# EAGLE design MD (EAGLE 9.6.2)
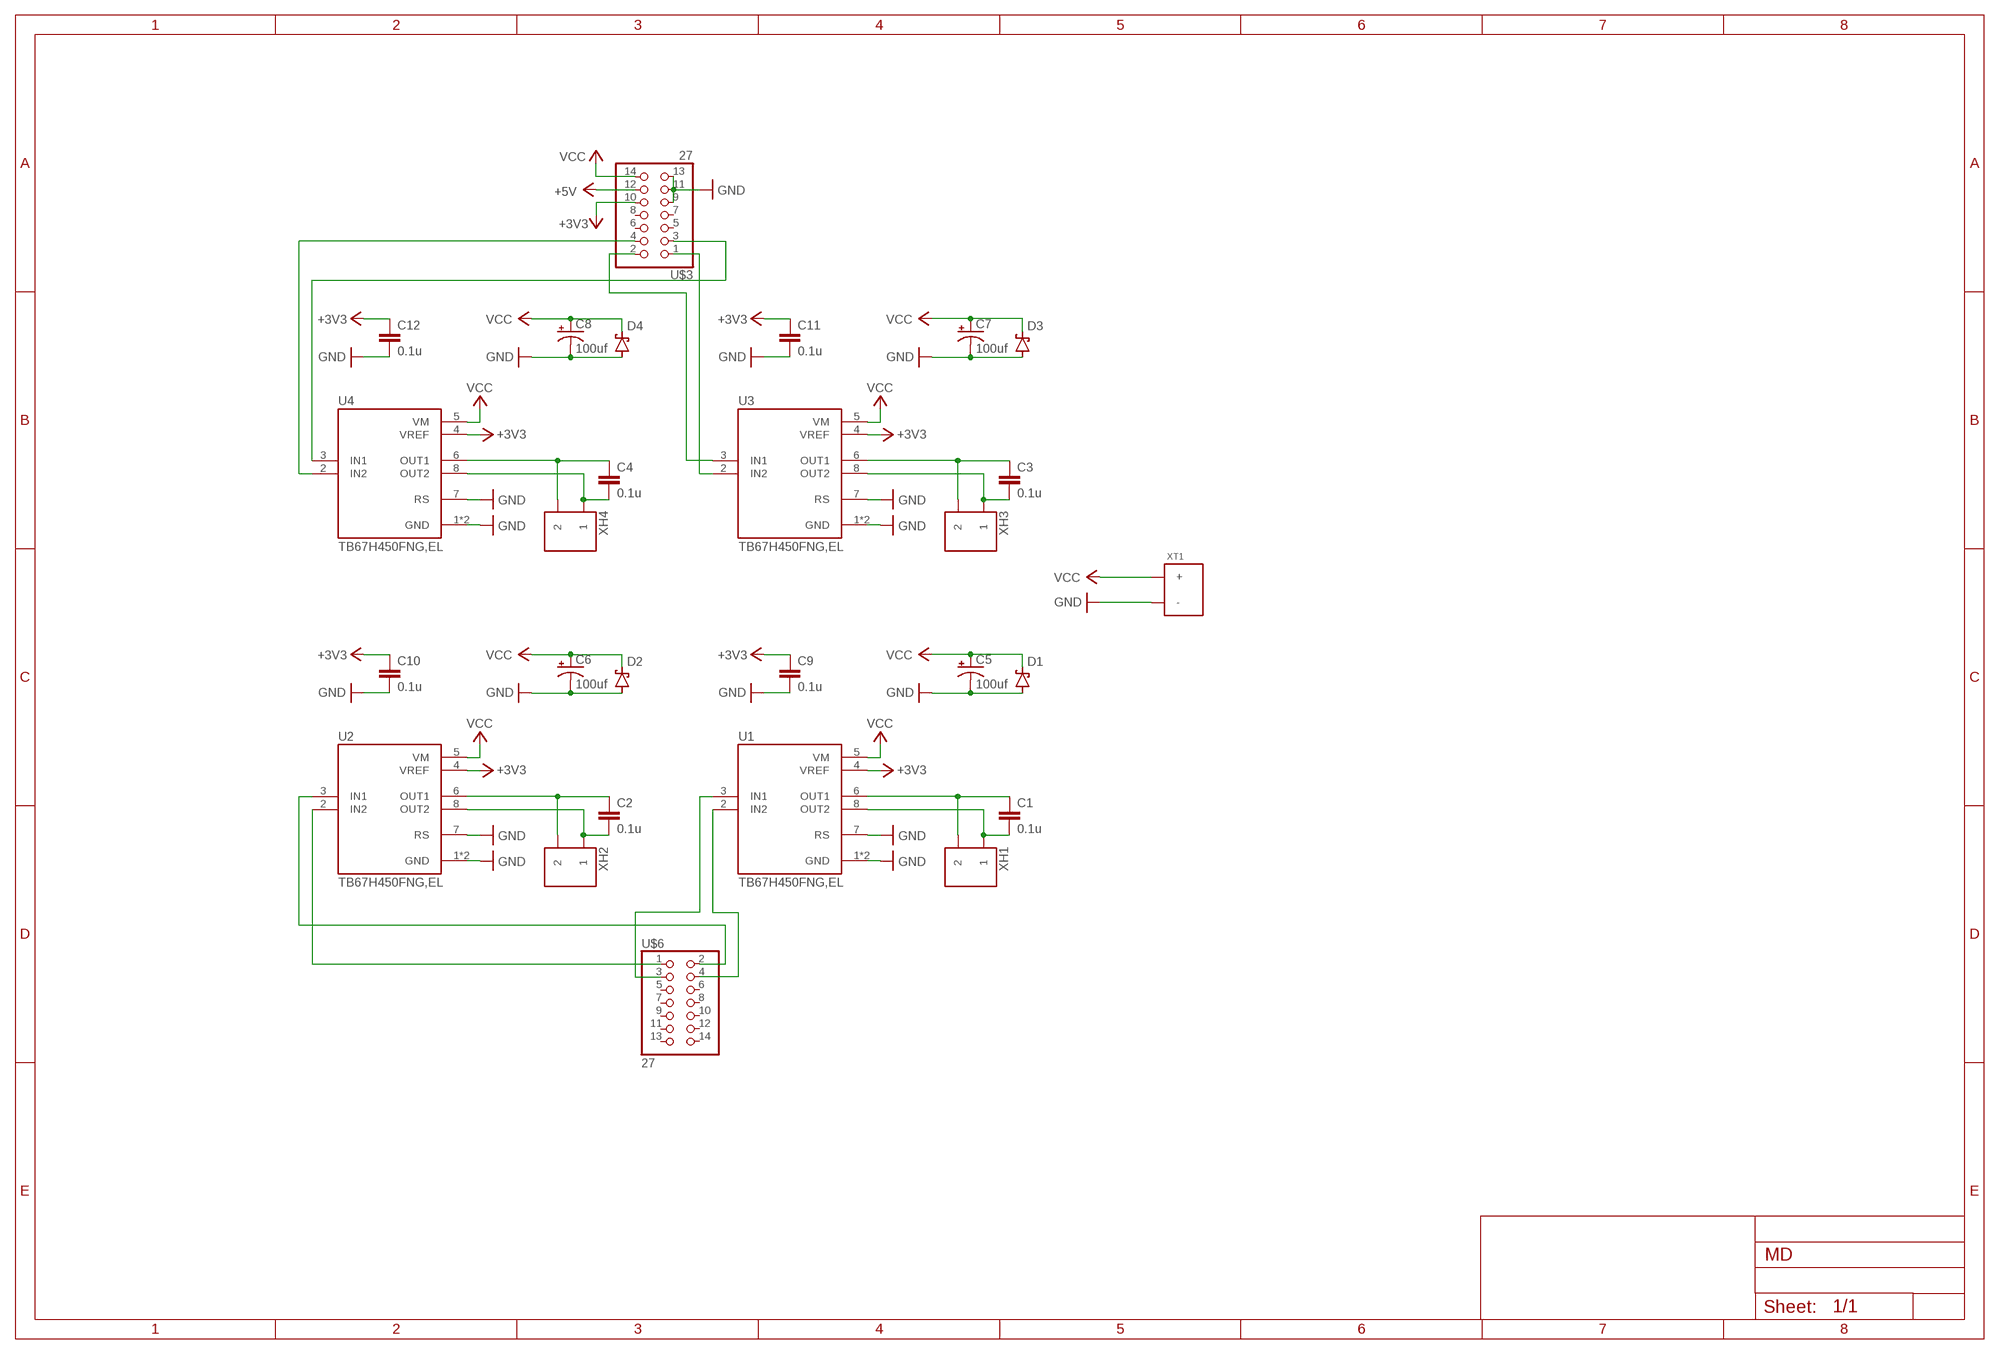
[diagram p0: schematic, sheet 1]

## Parts
C1  0.1u  C-EUC0603  [C0603]
C2  0.1u  C-EUC0603  [C0603]
C3  0.1u  C-EUC0603  [C0603]
C4  0.1u  C-EUC0603  [C0603]
C5  100uf  MH5  [MH5]
C6  100uf  MH5  [MH5]
C7  100uf  MH5  [MH5]
C8  100uf  MH5  [MH5]
C9  0.1u  C-EUC0603  [C0603]
C10  0.1u  C-EUC0603  [C0603]
C11  0.1u  C-EUC0603  [C0603]
C12  0.1u  C-EUC0603  [C0603]
D1  SS2040FL  [SOD123FL]
D2  SS2040FL  [SOD123FL]
D3  SS2040FL  [SOD123FL]
D4  SS2040FL  [SOD123FL]
U1  TB67H450FNG,EL  [SOIC127P599X175-9N]
U2  TB67H450FNG,EL  [SOIC127P599X175-9N]
U3  TB67H450FNG,EL  [SOIC127P599X175-9N]
U4  TB67H450FNG,EL  [SOIC127P599X175-9N]
U$3  27  [2*7]
U$6  27  [2*7]
XH1  S2B  [S2B]
XH2  S2B  [S2B]
XH3  S2B  [S2B]
XH4  S2B  [S2B]
XT1  XT30PW-M  [XT30PW-M]

## Nets
+3V3: C9.1 C10.1 C11.1 C12.1 U1.4(VREF) U2.4(VREF) U3.4(VREF) U4.4(VREF) U$3.10
+5V: U$3.12
GND: C5.- C6.- C7.- C8.- C9.2 C10.2 C11.2 C12.2 D1.A D2.A D3.A D4.A U1.1(GND) U1.7(RS) U1.9(GND) U2.1(GND) U2.7(RS) U2.9(GND) U3.1(GND) U3.7(RS) U3.9(GND) U4.1(GND) U4.7(RS) U4.9(GND) U$3.9 U$3.11 U$3.13 XT1.-
N$1: U1.3(IN1) U$6.3
N$2: C1.1 U1.6(OUT1) XH1.2
N$3: C1.2 U1.8(OUT2) XH1.1
N$4: C2.1 U2.6(OUT1) XH2.2
N$5: U1.2(IN2) U$6.4
N$6: C2.2 U2.8(OUT2) XH2.1
N$7: C3.1 U3.6(OUT1) XH3.2
N$8: C3.2 U3.8(OUT2) XH3.1
N$9: C4.1 U4.6(OUT1) XH4.2
N$10: C4.2 U4.8(OUT2) XH4.1
N$11: U2.3(IN1) U$6.2
N$12: U2.2(IN2) U$6.1
N$13: U3.2(IN2) U$3.1
N$14: U3.3(IN1) U$3.2
N$16: U4.2(IN2) U$3.4
N$17: U4.3(IN1) U$3.3
VCC: C5.+ C6.+ C7.+ C8.+ D1.C D2.C D3.C D4.C U1.5(VM) U2.5(VM) U3.5(VM) U4.5(VM) U$3.14 XT1.+
Unconnected: U$3.5 U$3.6 U$3.7 U$3.8 U$6.5 U$6.6 U$6.7 U$6.8 U$6.9 U$6.10 U$6.11 U$6.12 U$6.13 U$6.14

## Library data of the parts
C1-C4 C9-C12 = rcl:C-EU: CAPACITOR, European symbol; SPICEPREFIX: C
C5-C8 = capacitor:MH5
D1-D4 = diode:SS2040FL
U1-U4 = TB67H450FNG_EL:TB67H450FNG,EL: Check availability <https://pricing.snapeda.com/parts/TB67H450FNG%2CEL/Toshiba%20Semiconductor%20and%20Storage/view-part?ref=eda>; AVAILABILITY: In Stock; DESCRIPTION: - Motor Driver - - 8-HSOP; MF: Toshiba Semiconductor and Storage; MP: TB67H450FNG,EL; PACKAGE: SOIC-8 Toshiba Semiconductor and Storage; PRICE: None; PURCHASE-URL: https://pricing.snapeda.com/search/part/TB67H450FNG,EL/?ref=eda
U$3 U$6 = pin_socket:2*7
XH1-XH4 = XH:S2B
XT1 = XT:XT30PW-M

## Board
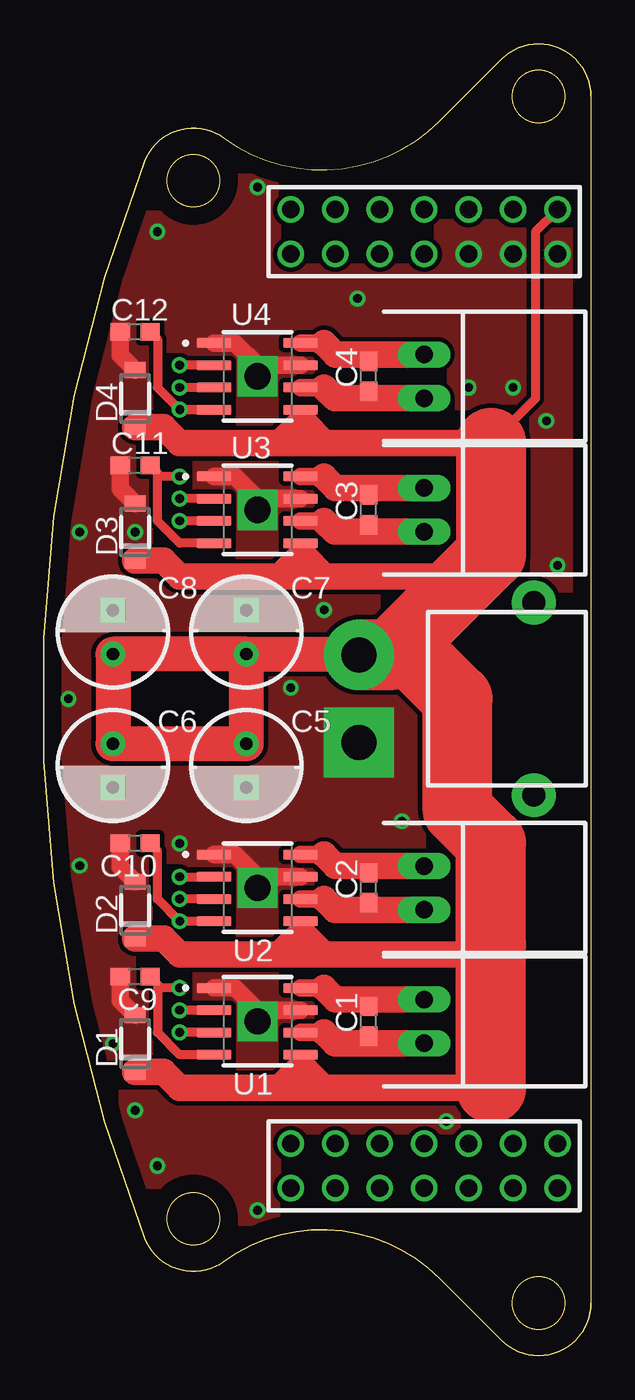
[diagram p1: board, top side]
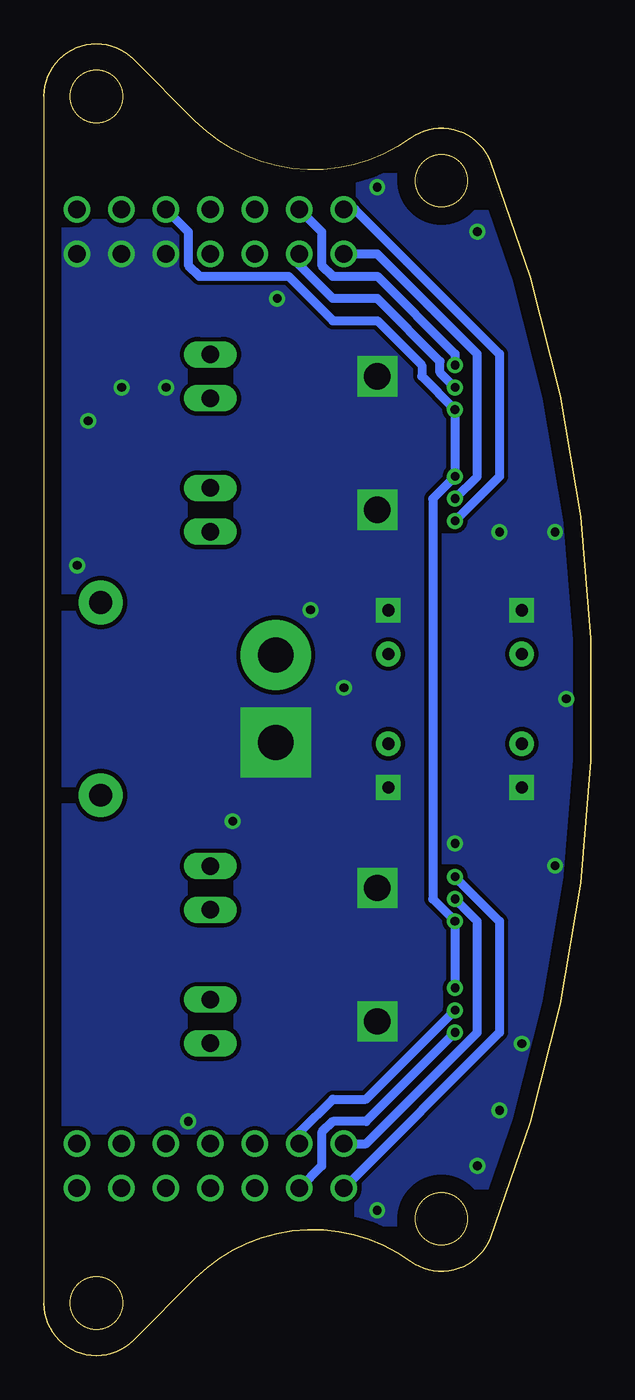
[diagram p2: board, bottom side, seen from below]

Size 31.26 x 74.91 mm. Coordinates in mm from the lower left corner, seen from the top.
Outline: 10.31,69.53 arc104 5.75,68.19
Outline: 5.75,68.19 arc43 5.75,6.72
Outline: 5.75,6.72 arc104 10.31,5.39
Outline: 10.31,5.39 arc-81 22.6,4.41
Outline: 22.6,4.41 26.14,0.88
Outline: 26.14,0.88 arc135 31.26,3
Outline: 31.26,71.91 arc135 26.14,74.03
Outline: 22.6,4.41 arc81 10.31,5.39
Outline: 10.31,5.39 arc-104 5.75,6.72
Outline: 5.75,6.72 arc-43 5.75,68.19
Outline: 5.75,68.19 arc-104 10.31,69.53
Outline: 10.31,69.53 arc81 22.6,70.5 26.14,74.03
Outline: 26.14,74.03 arc-135 31.26,71.91
Outline: 31.26,71.91 31.26,3
Outline: 31.26,3 arc-135 26.14,0.88
Outline: circle at 8.55,7.82 radius 1.5
Outline: circle at 28.26,71.91 radius 1.5
Outline: circle at 8.55,67.1 radius 1.5
Outline: circle at 28.26,3 radius 1.5
Copper layers (1*16): Top 0.035mm / dielectric 1.5mm / Bottom 0.035mm
Design rules "default": minimum track width 6mil, minimum drill 0.35mm, track to track 6mil, track to pad 6mil, pad to pad 6mil, via to via 6mil, smd to smd 6mil, copper to edge 40mil, drill to drill 6mil, minimum pad ring 10mil, minimum via ring 8mil, stop-mask expansion 4mil, vias tented up to drill 0mil, thermal gap 10mil

### Footprints (pad centres in the part's own frame; a part is rotated, then mirrored left to right if it is on the bottom)
C0603 = smd 1.1 x 1: 1 -0.85,0; 2 0.85,0
MH5 = drill 0.7 pad 1.4: + 1.25,0 | drill 0.7 pad 1.4 square: - -1.25,0
SOD123FL = smd 0.91 x 1.22: A 1.625,0; C -1.625,0
SOIC127P599X175-9N = smd 1.97 x 0.58: 1 -2.47,1.905; 2 -2.47,0.635; 3 -2.47,-0.635; 4 -2.47,-1.905; 5 2.47,-1.905; 6 2.47,-0.635; 7 2.47,0.635; 8 2.47,1.905 | drill 1.5 pad 2.285 square: 9 0,0
2*7 = drill 1: 1 -1.27,7.62; 2 1.27,7.62; 3 -1.27,5.08; 4 1.27,5.08; 5 -1.27,2.54; 6 1.27,2.54; 7 -1.27,0; 8 1.27,0; 9 -1.27,-2.54; 10 1.27,-2.54; 11 -1.27,-5.08; 12 1.27,-5.08; 13 -1.27,-7.62; 14 1.27,-7.62
S2B = drill 1 long: 1 0,1.25; 2 0,-1.25
XT30PW-M = drill 2 pad 4: + -5,2.5 | drill 2 pad 4 square: - -5,-2.5 | drill 1.3 pad 2.5: NC 5,5.5; NC1 5,-5.5

### Placement (x,y rotation side)
C1  18.56,19.09 90 top
C2  18.56,26.71 90 top
C3  18.56,48.3 90 top
C4  18.56,55.92 90 top
C5  11.57,33.7 90 top
C6  3.95,33.7 90 top
C7  11.57,41.32 270 top
C8  3.95,41.32 270 top
C9  5.22,21.63 180 top
C10  5.22,29.25 180 top
C11  5.22,50.84 180 top
C12  5.22,58.46 180 top
D1  5.22,17.82 90 top
D2  5.22,25.44 90 top
D3  5.22,47.03 90 top
D4  5.22,54.65 90 top
U1  12.21,19.09 0 top
U2  12.21,26.71 0 top
U3  12.21,48.3 0 top
U4  12.21,55.92 0 top
U$3  21.73,64.18 90 top
U$6  21.73,10.84 90 top
XH1  21.73,19.09 0 top
XH2  21.73,26.71 0 top
XH3  21.73,48.3 0 top
XH4  21.73,55.92 0 top
XT1  23,37.51 0 top

### Tracks (layer width: path | path; a pad name or v marks a point on that pad's centre or on a via)
+3V3  (via drill 0.5)
  Top 0.5: U1.4 7.76,17.19 6.49,18.46 6.49,21.21 C9.1 6.71,21 v7.76,21 | C10.1 6.49,28.83 6.49,26.08 v7.76,24.81 U2.4 v7.77,24.81 | U3.4 7.76,46.4 6.49,47.67 6.49,50.42 C11.1 6.71,50.21 v7.76,50.21 | C12.1 6.49,58.04 6.49,55.29 v7.76,54.02 U4.4 v7.77,54.02
  Bottom 0.5: U$3.10 23,64.18 23,62.27 22.37,61.64 17.29,61.64 14.75,59.1 12.21,59.1 9.67,56.56 9.67,55.92 v7.77,54.02 v7.77,50.21 v7.76,50.21 9.03,48.94 9.03,26.08 v7.77,24.81 v7.77,21 v7.76,21
GND  (via drill 0.5)
  Top 1: U4.1 10.94,57.83 12.21,56.56 | 12.21,56.56 U4.9 | U2.1 10.94,28.62 12.21,27.35 | 12.21,27.35 U2.9 | U2.7 12.21,27.35 | U1.1 10.94,21 12.21,19.73 | 12.21,19.73 U1.9 | U1.7 12.21,19.73 | U3.1 10.94,50.21 12.21,48.94 | 12.21,48.94 U3.9 | U3.7 12.21,48.94 | U4.7 12.21,56.56 | C9.2 4.37,20.3 D1.A | C10.2 4.37,27.92 D2.A | C11.2 4.37,49.51 D3.A | C12.2 4.37,57.13 D4.A
  other vias: 12.21,66.72 24.27,55.29 26.81,55.29 6.49,64.18 3.95,17.82 6.49,10.84 20.46,30.52 17.92,60.37 12.21,8.3 5.22,14.01 16.02,42.59 29.35,45.13 7.76,29.25 1.41,37.51 2.05,47.03 2.05,27.98 14.11,38.14 28.72,53.38 23,13.38 5.22,47.03
  pour Top (isolate 0.25, no thermals): -1.76,78.15 35.07,78.15 35.07,-1.86 -1.76,-1.86
  pour Bottom (isolate 0.25, no thermals): -0.49,80.69 33.8,80.69 33.8,-3.13 -0.49,-3.13
N$1  (via drill 0.5)
  Top 0.5: U1.3 v7.76,18.46
  Bottom 0.5: v7.76,18.46 12.84,13.38 14.75,13.38 15.38,12.74 15.38,10.84 U$6.3
N$2
  Top 1: 16.02,18.46 U1.6 | C1.1 18.56,17.84
  Top 1.5: 16.02,18.46 16.63,17.84 18.56,17.84 XH1.2
N$3
  Top 1: 16.02,21 U1.8 | C1.2 18.56,20.34
  Top 1.5: 16.02,21 16.67,20.34 18.56,20.34 XH1.1
N$4
  Top 1: 16.02,26.08 U2.6 | C2.1 18.56,25.46
  Top 1.5: 16.02,26.08 16.63,25.46 18.56,25.46 XH2.2
N$5  (via drill 0.5)
  Top 0.5: U1.2 v7.76,19.73
  Bottom 0.5: U$6.4 16.65,12.74 14.75,14.65 12.84,14.65 v7.76,19.73
N$6
  Top 1: 16.02,28.62 U2.8 | C2.2 18.56,27.96
  Top 1.5: 16.02,28.62 16.67,27.96 18.56,27.96 XH2.1
N$7
  Top 1: 16.02,47.67 U3.6 | C3.1 18.56,47.05
  Top 1.5: 16.02,47.67 16.63,47.05 18.56,47.05 XH3.2
N$8
  Top 1: 16.02,50.21 U3.8 | C3.2 18.56,49.55
  Top 1.5: 16.02,50.21 16.67,49.55 18.56,49.55 XH3.1
N$9
  Top 1: 16.02,55.29 U4.6 | C4.1 18.56,54.67
  Top 1.5: 16.02,55.29 16.63,54.67 18.56,54.67 XH4.2
N$10
  Top 1: 16.02,57.83 U4.8 | C4.2 18.56,57.17
  Top 1.5: 16.02,57.83 16.67,57.17 18.56,57.17 XH4.1
N$11  (via drill 0.5)
  Top 0.5: U2.3 v7.76,26.08
  Bottom 0.5: U$6.2 12.84,12.11 6.49,18.46 6.49,24.81 v7.76,26.08
N$12  (via drill 0.5)
  Top 0.5: v7.76,27.35 U2.2
  Bottom 0.5: v7.76,27.35 5.22,24.81 5.22,18.46 U$6.1
N$13  (via drill 0.5)
  Top 0.5: U3.2 v7.76,48.94
  Bottom 0.5: v7.76,48.94 6.49,50.21 6.49,57.19 12.21,62.91 U$3.1
N$14  (via drill 0.5)
  Top 0.5: U3.3 v7.76,47.67
  Bottom 0.5: v7.76,47.67 5.22,50.21 5.22,57.19 13.48,65.45 U$3.2
N$16  (via drill 0.5)
  Top 0.5: U4.2 v7.76,56.56
  Bottom 0.5: U$3.4 15.38,64.18 15.38,62.27 14.75,61.64 12.21,61.64 7.76,57.19 v7.76,56.56
N$17  (via drill 0.5)
  Top 0.5: U4.3 v7.76,55.29
  Bottom 0.5: U$3.3 16.65,62.27 14.75,60.37 12.21,60.37 8.62,56.78 8.62,56.14 v7.76,55.29
VCC
  Top 0.5: U4.5 14.75,53.95 14.75,53.38 | U3.5 14.75,46.33 14.75,45.76 | U2.5 14.75,24.74 14.75,24.17 | U1.5 14.75,17.12 14.75,16.55 | U$3.14 28.08,64.18 28.08,54.65 25.54,52.11
  Top 1.5: 16.02,52.11 25.54,52.11 | 16.02,15.28 25.54,15.28 | 16.02,22.9 24.91,22.9 25.54,23.54 | 16.02,44.49 24.27,44.49 25.54,45.76 | D2.C 6.85,23.82 7.76,22.9 13.48,22.9 | D1.C 6.85,16.2 7.76,15.28 9.67,15.28 13.48,15.28 | D3.C 6.85,45.41 7.76,44.49 13.48,44.49 | D4.C 6.85,53.03 7.76,52.11 13.48,52.11 | 13.48,15.28 14.75,16.55 16.02,15.28 | 13.48,22.9 14.75,24.17 16.02,22.9 | 13.48,44.49 14.75,45.76 16.02,44.49 | 13.48,52.11 14.75,53.38 16.02,52.11 | 13.48,22.9 16.02,22.9 | 13.48,44.49 16.02,44.49 | 13.48,52.11 16.02,52.11 | 13.48,15.28 16.02,15.28
  Top 2: XT1.+ 17.94,40.07 C7.+ | C7.+ C5.+ C6.+ C8.+ C7.+
  Top 4: 25.54,52.11 25.54,45.76 19.79,40.01 XT1.+ 18.04,40.05 21.1,40.05 23.64,37.51 23.64,31.16 25.54,29.25 25.54,23.54 25.54,15.28